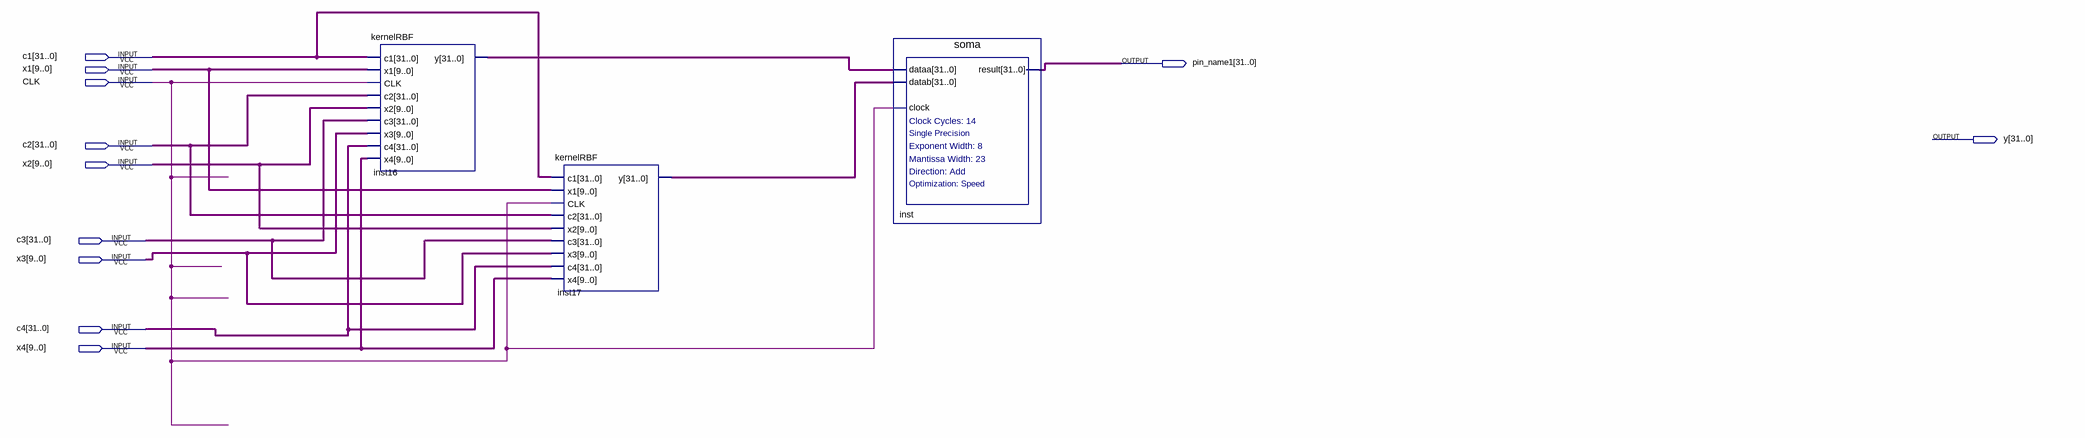
[diagram p0: schematic sheet]
// Quartus schematic projetoSD.bdf as structural Verilog: 3 symbols, 11 pins
module projetoSD (
  input  [31:0] c1,
  input  [9:0] x1,
  input  CLK,
  input  [31:0] c2,
  input  [9:0] x2,
  input  [31:0] c3,
  input  [9:0] x3,
  input  [31:0] c4,
  input  [9:0] x4,
  output [31:0] pin_name1,
  output [31:0] y
);

  wire [31:0] inst16_y, inst17_y;

  kernelRBF inst16 (.c1(c1), .x1(x1), .CLK(CLK), .c2(c2), .x2(x2), .c3(c3), .x3(x3), .c4(c4), .x4(x4), .y(inst16_y));
  kernelRBF inst17 (.c1(c1), .x1(x1), .CLK(CLK), .c2(c2), .x2(x2), .c3(c3), .x3(x3), .c4(c4), .x4(x4), .y(inst17_y));
  soma inst (.dataa(inst16_y), .datab(inst17_y), .clock(CLK), .result(pin_name1));
endmodule
